# Altium project VapourPhaseReflowShield.PrjPcb
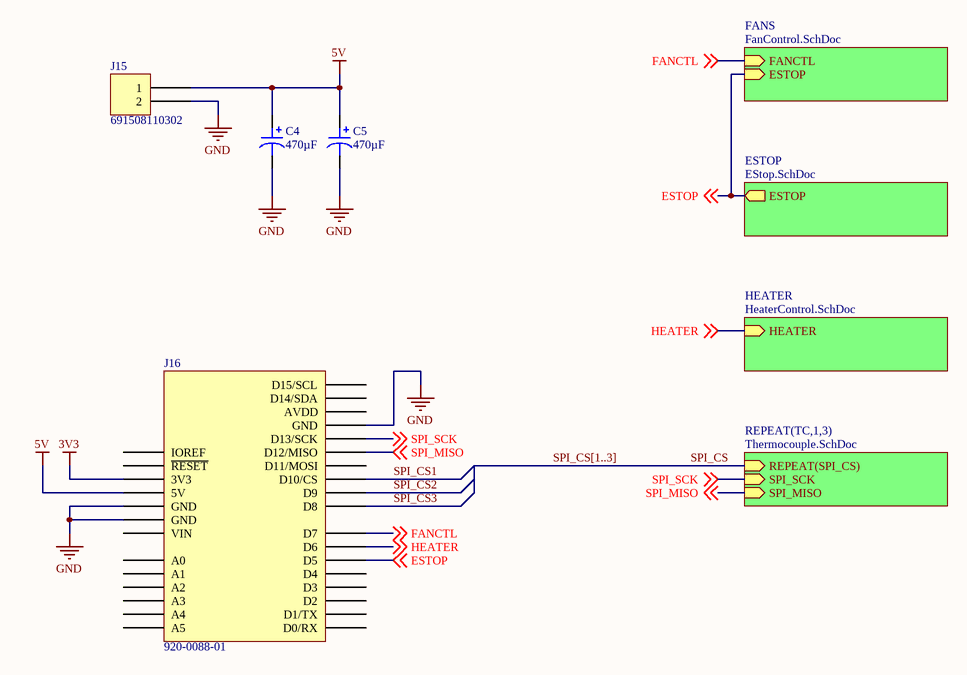
[diagram p0: VapourPhaseController.SchDoc]
5 sheets, 38 parts. Net scope: hierarchical (ports join the sheet entries above them; power ports are global).
Board file: Vapour Phase Shield.PcbDoc
Sheets:
  VapourPhaseController.SchDoc
    FANS = FanControl.SchDoc
    HEATER = HeaterControl.SchDoc
    TC1 = Thermocouple.SchDoc
    TC2 = Thermocouple.SchDoc
    TC3 = Thermocouple.SchDoc
    ESTOP = EStop.SchDoc

## Sheet VapourPhaseController.SchDoc: Vapour Phase Reflow Shield
size A4

### Parts
C4  470µF  [CAP AL TH D8 L3.5 H12.5]
C5  470µF  [CAP AL TH D8 L3.5 H12.5]
J15  691508110302  [WURTH 691508110302]
J16  920-0088-01  [SCHMARTBOARD - 920-0088-01]

### Sub-sheets
ESTOP = EStop.SchDoc: ESTOP (out)
FANS = FanControl.SchDoc: FANCTL (in), ESTOP (in)
HEATER = HeaterControl.SchDoc: HEATER (in)
REPEAT(TC,1,3) = Thermocouple.SchDoc: SPI_SCK (in), REPEAT(SPI_CS) (in), SPI_MISO (in)

### Nets
3V3: J16.4(3V3)
5V: C4.1 C5.1 J15.1 J16.5(5V)
GND: C4.2 C5.2 J15.2 J16.6(GND) J16.7(GND) J16.29(GND)
ESTOP: J16.20(D5) ; off-sheet ESTOP, sheet FANS/ESTOP, sheet ESTOP/ESTOP
FANCTL: J16.22(D7) ; off-sheet FANCTL, sheet FANS/FANCTL
HEATER: J16.21(D6) ; off-sheet HEATER, sheet HEATER/HEATER  [project net HEATCTL]
SPI_CS: sheet REPEAT(TC,1,3)/REPEAT(SPI_CS)
SPI_CS1: J16.25(D10/CS)
SPI_CS2: J16.24(D9)
SPI_CS3: J16.23(D8)
SPI_MISO: J16.27(D12/MISO) ; off-sheet SPI_MISO, sheet REPEAT(TC,1,3)/SPI_MISO
SPI_SCK: J16.28(D13/SCK) ; off-sheet SPI_SCK, sheet REPEAT(TC,1,3)/SPI_SCK

Not connected (* = marked no-connect by the designer): J16 2(IOREF) 3(~{RESET}) 8(VIN) 9(A0) 10(A1) 11(A2) 12(A3) 13(A4) 14(A5) 15(D0/RX) 16(D1/TX) 17(D2) 18(D3) 19(D4) 26(D11/MOSI) 30(AVDD) 31(D14/SDA) 32(D15/SCL)

### Buses and harness runs
bus SPI_CS[1..3]

### Notes on the sheet
- Title
- Size:
- Date:
- A4
- Number:
- Time:
- Revision:
- Sheet
- of
- File:

### Library data of the parts
C4 C5 = ECA-1CM471: CAP ALUM 470UF 20% 16V RADIAL; Manufacturer: Panasonic Electronic Components; Lifetime @ Temp.: 2000 Hrs @ 85°C; Polarization: Polar; Ripple Current @ High Frequency: 748mA @ 10kHz; Ripple Current @ Low Frequency: 440mA @ 120Hz; Part Number: ECA-1CM471; Applications: General Purpose; Capacitance: 470µF; ComponentLink1Description: Datasheet; ComponentLink1URL: //media.digikey.com/pdf/Data%20Sheets/Panasonic%20Electronic%20Components/ECA-xxM%20Series,TypeA.pdf; ComponentLink2Description: DigiKey Link; ComponentLink2URL: http://digikey.com/product-detail/en/panasonic-electronic-components/ECA-1CM471/P5141-ND/245000; Device Package: Radial, Can; Height - Seated (Max): 0.492" (12.50mm); LastUpdated: 21/01/2020 03:40:57; Lead Spacing: 0.138" (3.50mm); Lifecycle Status: Active; Minimum Order: 1; Mounting Type: Through Hole; Operating Temperature: -40°C ~ 85°C; Package / Case: Radial, Can; Packaging: Bulk; PartId: 7263; Part Status: Active; Price: 0.10; Series: M; Size / Dimension: 0.315" Dia (8.00mm); Supplier 1: DigiKey; Supplier Part Number 1: P5141-ND; Tolerance: ±20%; Value: 470µF; Voltage - Rated: 16V
J15 = 691508110302: TERM BLOCK 2POS 3.5MM SMD; Manufacturer: Würth Elektronik; Current: 10A; Mating Orientation: Horizontal and Vertical with Board; Number of Levels: 1; Pitch: 0.138" (3.50mm); Positions Per Level: 2; Voltage: 300V; Wire Gauge: 16-30 AWG; Wire Termination: Screw - Rising Cage Clamp; Part Number: 691508110302; Color: Black; ComponentLink1Description: Datasheet; ComponentLink1URL: https://katalog.we-online.de/em/datasheet/6915081103xx.pdf; ComponentLink2Description: DigiKey Link; ComponentLink2URL: http://digikey.com/product-detail/en/w-rth-elektronik/691508110302/732-5963-1-ND/5047612; Features: Board Guide, Mounting Flange; LastUpdated: 15/01/2020 04:18:55; Lifecycle Status: Active; Minimum Order: 1; Mounting Type: Surface Mount; Packaging: TapeAndReel; Part Status: Active; Price: 1.57; Series: WR-TBL Series 5081; Supplier 1: DigiKey; Supplier Part Number 1: 732-5963-1-ND
J16 = 920-0088-01: CONN HDR 8/10P 0.1 GOLD PCB 6PC; Manufacturer: Schmartboard, Inc.; Connector Type: Header; Contact Length - Post: 0.413" (10.50mm); Number of Positions: 6, 8, 10; Number of Positions Loaded: All; Pitch - Mating: 0.100" (2.54mm); Style: Board to Board; ComponentLink1Description: Datasheet; ComponentLink1URL: http://schmartboard.com/content/Brochures/920-0088-01.pdf; ComponentLink2Description: DigiKey Link; ComponentLink2URL: http://digikey.com/product-detail/en/schmartboard-inc/920-0088-01/1988-1036-ND/9559319; Contact Finish - Mating: Gold; Contact Finish - Post: Gold; Contact Type: Female Socket; Fastening Type: Push-Pull; Insulation Color: Black; Insulation Height: 0.335" (8.51mm); LastUpdated: 31/01/2020 20:49:58; Lifecycle Status: Active; Part Number: 920-0088-01; Minimum Order: 1; Mounting Type: Through Hole; Number of Rows: 1; Packaging: Bulk; Part Status: Active; Price: 5.00; Series: -; Supplier 1: DigiKey; Supplier Part Number 1: 1988-1036-ND; Termination: Solder

## Sheet FanControl.SchDoc
size A4
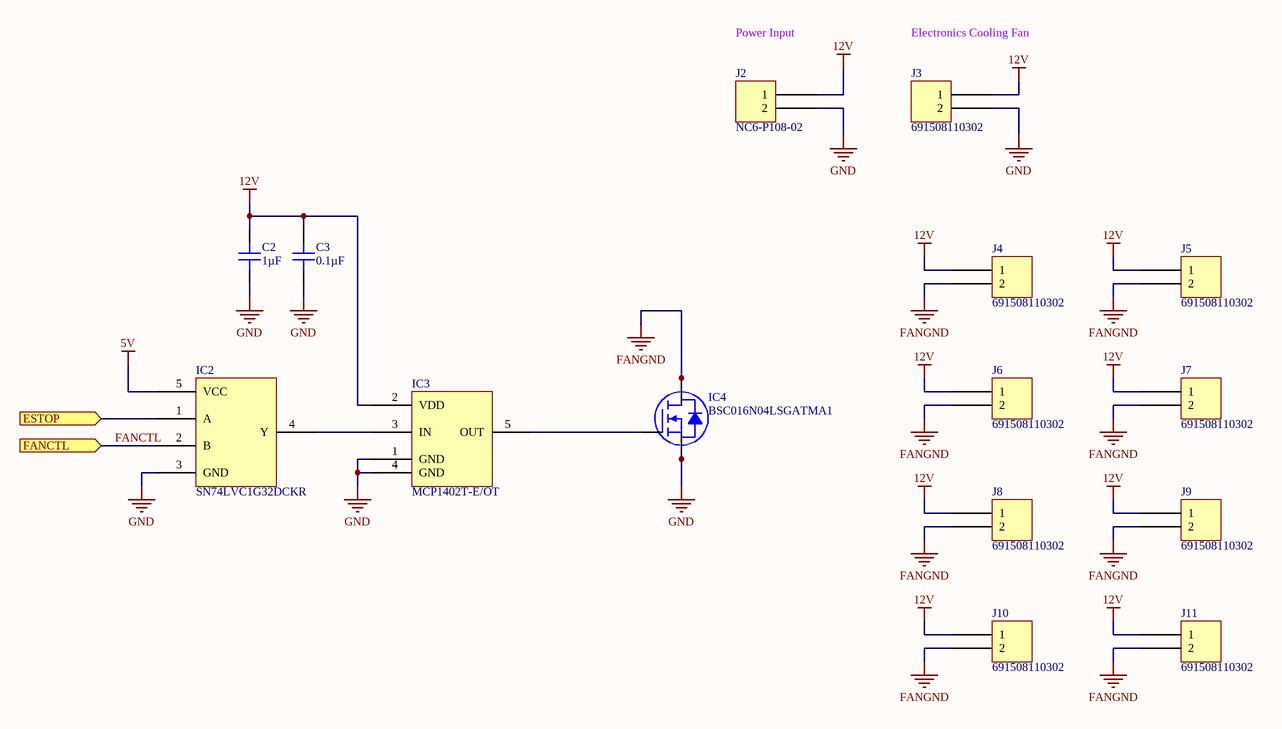
[diagram p1: FanControl.SchDoc]

### Parts
C2  1µF  [CAP 0603_1608]
C3  0.1µF  [CAP 0603_1608]
IC2  SN74LVC1G32DCKR  [TI SC70-6 DCK]
IC3  MCP1402T-E/OT  [MICROCHIP SOT-23-5 OT]
IC4  BSC016N04LSGATMA1  [INFINEON PG-TDSON-8]
J2  NC6-P108-02  [TE NC6-P108-02]
J3  691508110302  [WURTH 691508110302]
J4  691508110302  [WURTH 691508110302]
J5  691508110302  [WURTH 691508110302]
J6  691508110302  [WURTH 691508110302]
J7  691508110302  [WURTH 691508110302]
J8  691508110302  [WURTH 691508110302]
J9  691508110302  [WURTH 691508110302]
J10  691508110302  [WURTH 691508110302]
J11  691508110302  [WURTH 691508110302]

### Ports
ESTOP (in), FANCTL (in)

### Nets
5V: IC2.5(VCC)
12V: C2.2 C3.2 IC3.2(VDD) J2.1 J3.1 J4.1 J5.1 J6.1 J7.1 J8.1 J9.1 J10.1 J11.1
FANGND: IC4.5(D) IC4.6(D) IC4.7(D) IC4.8(D) J4.2 J5.2 J6.2 J7.2 J8.2 J9.2 J10.2 J11.2
GND: C2.1 C3.1 IC2.3(GND) IC3.1(GND) IC3.4(GND) IC4.1(S) IC4.2(S) IC4.3(S) J2.2 J3.2
ESTOP: IC2.1(A) ; port ESTOP
FANCTL: IC2.2(B) ; port FANCTL
NetIC2_4: IC2.4(Y) IC3.3(IN)
NetIC3_5: IC3.5(OUT) IC4.4(G)

### Notes on the sheet
- Power Input
- Electronics Cooling Fan
- Title
- Size:
- Date:
- A4
- Number:
- Time:
- Revision:
- Sheet
- of
- File:

### Library data of the parts
C2 = CC0603KRX5R8BB105: CAP CER 1UF 25V X5R 0603; Manufacturer: Yageo; Tolerance: ±10%; Part Number: CC0603KRX5R8BB105; Value: 1µF; Applications: General Purpose; Capacitance: 1µF; ComponentLink1Description: Datasheet; ComponentLink1URL: https://www.yageo.com/upload/media/product/productsearch/datasheet/mlcc/UPY-GPHC_X5R_4V-to-50V_25.pdf; ComponentLink2Description: DigiKey Link; ComponentLink2URL: http://digikey.com/product-detail/en/yageo/CC0603KRX5R8BB105/311-1445-1-ND/2833751; Device Package: 0603 (1608 Metric); LastUpdated: 21/01/2020 00:02:05; Lifecycle Status: Active; Minimum Order: 1; Mounting Type: Surface Mount, MLCC; Operating Temperature: -55°C ~ 85°C; Package / Case: 0603 (1608 Metric); Packaging: TapeAndReel; PartId: 5146; Part Status: Active; Price: 0.01; Series: CC; Size / Dimension: 0.063" L x 0.031" W (1.60mm x 0.80mm); Supplier 1: DigiKey; Supplier Part Number 1: 311-1445-1-ND; Temperature Coefficient: X5R; Thickness (Max): 0.035" (0.90mm); Voltage - Rated: 25V
C3 = 06035C104JAT4A: CAP CER 0.1UF 50V X7R 0603; Manufacturer: AVX Corporation; Tolerance: ±5%; Part Number: 06035C104JAT4A; Value: 0.1µF; Applications: General Purpose; Capacitance: 0.1µF; ComponentLink1Description: Datasheet; ComponentLink1URL: http://datasheets.avx.com/X7RDielectric.pdf; ComponentLink2Description: DigiKey Link; ComponentLink2URL: http://digikey.com/product-detail/en/avx-corporation/06035C104JAT4A/478-12459-1-ND/9749311; Device Package: 0603 (1608 Metric); LastUpdated: 21/01/2020 00:02:08; Lifecycle Status: Active; Minimum Order: 1; Mounting Type: Surface Mount, MLCC; Operating Temperature: -55°C ~ 125°C; Package / Case: 0603 (1608 Metric); Packaging: TapeAndReel; PartId: 3002; Part Status: Active; Price: 0.01; Series: -; Size / Dimension: 0.063" L x 0.032" W (1.60mm x 0.81mm); Supplier 1: DigiKey; Supplier Part Number 1: 478-12459-1-ND; Temperature Coefficient: X7R; Thickness (Max): 0.035" (0.90mm); Voltage - Rated: 50V
IC2 = SN74LVC1G32DCKR: IC GATE OR 1CH 2-INP SC70-5; Manufacturer: Texas Instruments; Current - Output High, Low: 32mA, 32mA; Current - Quiescent (Max): 10µA; Logic Level - High: 1.7V ~ 2V; Logic Level - Low: 0.7V ~ 0.8V; Logic Type: OR Gate; Max Propagation Delay @ V, Max CL: 4ns @ 5V, 50pF; Number of Circuits: 1; Number of Inputs: 2; Voltage - Supply: 1.65V ~ 5.5V; Part Number: SN74LVC1G32DCKR; ComponentLink1Description: Datasheet; ComponentLink1URL: http://www.ti.com/general/docs/suppproductinfo.tsp?distId=10&gotoUrl=http%3A%2F%2Fwww.ti.com%2Flit%2Fgpn%2Fsn74lvc1g32; ComponentLink2Description: DigiKey Link; ComponentLink2URL: http://digikey.com/product-detail/en/texas-instruments/SN74LVC1G32DCKR/296-9848-1-ND/380106; Device Package: 5-TSSOP, SC-70-5, SOT-353; LastUpdated: 31/01/2020 03:20:00; Lifecycle Status: Active; Minimum Order: 1; Mounting Type: Surface Mount; Operating Temperature: -40°C ~ 125°C; Package / Case: 5-TSSOP, SC-70-5, SOT-353; Packaging: TapeAndReel; PartId: 3; Part Status: Active; Price: 0.05; Series: 74LVC; Supplier 1: DigiKey; Supplier Part Number 1: 296-9848-1-ND; Supplier Device Package: SC-70-5
IC3 = MCP1402T-E/OT: IC GATE DRVR LOW-SIDE SOT23-5; Manufacturer: Microchip Technology; Channel Type: Single; Current - Peak Output (Source, Sink): 500mA, 500mA; Gate Type: IGBT, N-Channel, P-Channel MOSFET; Input Type: Non-Inverting; Logic Voltage - VIL, VIH: 0.8V, 2.4V; Number of Drivers: 1; Rise / Fall Time (Typ): 19ns, 15ns; Voltage - Supply: 4.5V ~ 18V; Part Number: MCP1402T-E/OT; ComponentLink1Description: Datasheet; ComponentLink1URL: http://www.microchip.com/mymicrochip/filehandler.aspx?ddocname=en530890; ComponentLink2Description: DigiKey Link; ComponentLink2URL: http://digikey.com/product-detail/en/microchip-technology/MCP1402T-E-OT/MCP1402T-E-OTCT-ND/1956554; Device Package: SC-74A, SOT-753; Driven Configuration: Low-Side; LastUpdated: 31/01/2020 01:34:33; Lifecycle Status: Active; Minimum Order: 1; Mounting Type: Surface Mount; Operating Temperature: -40°C ~ 150°C (TJ); Package / Case: SC-74A, SOT-753; Packaging: TapeAndReel; PartId: 10; Part Status: Active; Price: 0.47; Series: -; Supplier 1: DigiKey; Supplier Part Number 1: MCP1402T-E/OTCT-ND; Supplier Device Package: SOT-23-5
IC4 = BSC016N04LSGATMA1: MOSFET N-CH 40V 100A TDSON-8; Manufacturer: Infineon Technologies; Current - Continuous Drain (Id) @ 25°C: 31A (Ta), 100A (Tc); Drive Voltage (Max Rds On,  Min Rds On): 4.5V, 10V; FET Type: N-Channel; Gate Charge (Qg) (Max) @ Vgs: 150nC @ 10V; Input Capacitance (Ciss) (Max) @ Vds: 12000pF @ 20V; Power Dissipation (Max): 2.5W (Ta), 139W (Tc); Rds On (Max) @ Id, Vgs: 1.6mOhm @ 50A, 10V; Vgs (Max): ±20V; Vgs(th) (Max) @ Id: 2V @ 85µA; Part Number: BSC016N04LSGATMA1; ComponentLink1Description: Datasheet; ComponentLink1URL: https://www.infineon.com/dgdl/BSC016N04LSG_rev1.6.pdf?folderId=db3a304313b8b5a60113cee8763b02d7&fileId=db3a304318a6cd680118efe284830226; ComponentLink2Description: DigiKey Link; ComponentLink2URL: http://digikey.com/product-detail/en/infineon-technologies/BSC016N04LSGATMA1/BSC016N04LSGATMA1CT-ND/2231025; Device Package: 8-PowerTDFN; Drain to Source Voltage (Vdss): 40V; LastUpdated: 21/01/2020 03:59:50; Lifecycle Status: Active; Minimum Order: 1; Mounting Type: Surface Mount; Operating Temperature: -55°C ~ 150°C (TJ); Package / Case: 8-PowerTDFN; Packaging: TapeAndReel; Part Status: Active; Price: 0.95; Series: OptiMOS™; Supplier 1: DigiKey; Supplier Part Number 1: BSC016N04LSGATMA1CT-ND; Supplier Device Package: PG-TDSON-8-1; Technology: MOSFET (Metal Oxide)
J2 = NC6-P108-02: CONN BARRIER STRIP 2CIRC 0.375"; Manufacturer: TE Connectivity AMP Connectors; Barrier Type: 2 Wall (Dual); Bottom Termination: PC Pin; Current Rating (Amps): 20A; Number of Circuits: 2; Pitch: 0.375" (9.53mm); Top Termination: Screws with Captive Plate; Voltage Rating: 300V; Wire Gauge: 12-22 AWG; Part Number: NC6-P108-02; Color: Black; ComponentLink1Description: Datasheet; ComponentLink1URL: https://www.te.com/commerce/DocumentDelivery/DDEController?Action=srchrtrv&DocNm=3-1437664-0&DocType=Customer+Drawing&DocLang=English; ComponentLink2Description: DigiKey Link; ComponentLink2URL: http://digikey.com/product-detail/en/te-connectivity-amp-connectors/NC6-P108-02/A98495-ND/1277926; LastUpdated: 15/01/2020 04:11:24; Lifecycle Status: Active; Minimum Order: 1; Number of Rows: 1; Number of Wire Entries: 2; Packaging: Bulk; Part Status: Active; Price: 1.56; Series: NC6, Buchanan; Supplier 1: DigiKey; Supplier Part Number 1: A98495-ND; Terminal Block Type: Barrier Block
J3-J11 = 691508110302: as J15 on sheet VapourPhaseController; Part Number: 691508110302; Color: Black; ComponentLink1Description: Datasheet; ComponentLink1URL: https://katalog.we-online.de/em/datasheet/6915081103xx.pdf; ComponentLink2Description: DigiKey Link; ComponentLink2URL: http://digikey.com/product-detail/en/w-rth-elektronik/691508110302/732-5963-1-ND/5047612; Features: Board Guide, Mounting Flange; LastUpdated: 15/01/2020 04:18:55; Lifecycle Status: Active; Minimum Order: 1; Mounting Type: Surface Mount; Packaging: TapeAndReel; Part Status: Active; Price: 1.57; Series: WR-TBL Series 5081; Supplier 1: DigiKey; Supplier Part Number 1: 732-5963-1-ND

## Sheet HeaterControl.SchDoc
size A4
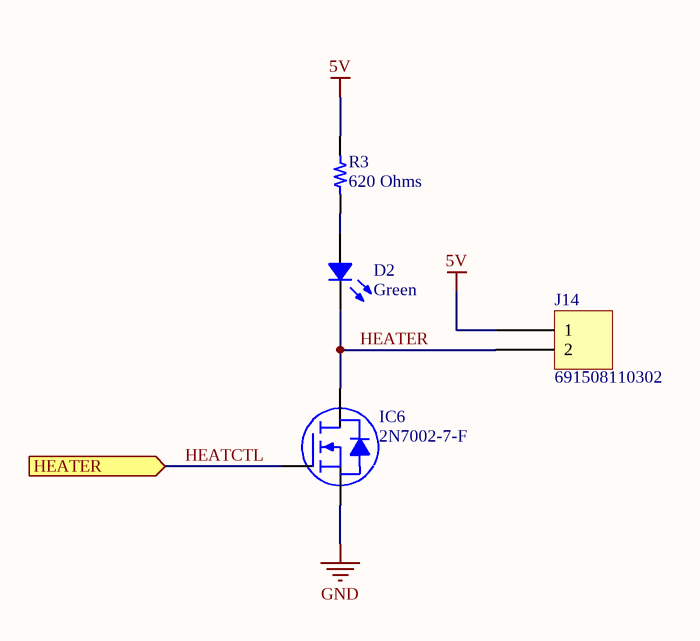
[diagram p2: HeaterControl.SchDoc]

### Parts
D2  Green  [LED 0603_1608 GREEN]
IC6  2N7002-7-F  [DIODES SOT-23-3]
J14  691508110302  [WURTH 691508110302]
R3  620 Ohms  [RES 0603_1608]

### Ports
HEATER (in)

### Nets
5V: J14.1 R3.2
GND: IC6.2(S)
HEATCTL: IC6.1(G) ; port HEATER
HEATER: D2.2 IC6.3(D) J14.2
NetD2_1: D2.1 R3.1

### Notes on the sheet
- Title
- Size:
- Date:
- A4
- Number:
- Time:
- Revision:
- Sheet
- of
- File:

### Library data of the parts
D2 = LTST-C190KGKT: LED GREEN CLEAR CHIP SMD; Manufacturer: Lite-On Inc.; Configuration: Standard; Current - Test: 20mA; Lens Color: Colorless; Lens Size: 1.10mm x 0.80mm; Lens Style: Rectangle with Flat Top; Millicandela Rating: 35mcd; Viewing Angle: 130°; Voltage - Forward (Vf) (Typ): 2V; Wavelength - Dominant: 571nm; Wavelength - Peak: 574nm; Part Number: LTST-C190KGKT; Color: Green; ComponentLink1Description: Datasheet; ComponentLink1URL: http://optoelectronics.liteon.com/upload/download/DS22-2000-074/LTST-C190KGKT.PDF; ComponentLink2Description: DigiKey Link; ComponentLink2URL: http://digikey.com/product-detail/en/lite-on-inc/LTST-C190KGKT/160-1435-1-ND/386814; Device Package: 0603 (1608 Metric); Height (Max): 0.90mm; LastUpdated: 21/01/2020 03:12:09; Lens Transparency: Clear; Lifecycle Status: Active; Minimum Order: 1; Mounting Type: Surface Mount; Package / Case: 0603 (1608 Metric); Packaging: TapeAndReel; PartId: 657; Part Status: Active; Price: 0.04; Series: -; Size / Dimension: 1.60mm L x 0.80mm W; Supplier 1: DigiKey; Supplier Part Number 1: 160-1435-1-ND; Supplier Device Package: Chip LED; Value: Green
IC6 = 2N7002-7-F: MOSFET N-CH 60V 115MA SOT23-3; Manufacturer: Diodes Incorporated; Current - Continuous Drain (Id) @ 25°C: 115mA (Ta); Drive Voltage (Max Rds On,  Min Rds On): 5V, 10V; FET Type: N-Channel; Input Capacitance (Ciss) (Max) @ Vds: 50pF @ 25V; Power Dissipation (Max): 370mW (Ta); Rds On (Max) @ Id, Vgs: 7.5Ohm @ 50mA, 5V; Vgs (Max): ±20V; Vgs(th) (Max) @ Id: 2.5V @ 250µA; Part Number: 2N7002-7-F; ComponentLink1Description: Datasheet; ComponentLink1URL: https://www.diodes.com/assets/Datasheets/ds11303.pdf; ComponentLink2Description: DigiKey Link; ComponentLink2URL: http://digikey.com/product-detail/en/diodes-incorporated/2N7002-7-F/2N7002-FDICT-ND/717800; Device Package: TO-236-3, SC-59, SOT-23-3; Drain to Source Voltage (Vdss): 60V; LastUpdated: 21/01/2020 04:00:25; Lifecycle Status: Active; Minimum Order: 1; Mounting Type: Surface Mount; Operating Temperature: -55°C ~ 150°C (TJ); Package / Case: TO-236-3, SC-59, SOT-23-3; Packaging: TapeAndReel; Part Status: Active; Price: 0.03; Series: -; Supplier 1: DigiKey; Supplier Part Number 1: 2N7002-FDICT-ND; Supplier Device Package: SOT-23-3; Technology: MOSFET (Metal Oxide)
J14 = 691508110302: as J15 on sheet VapourPhaseController; Part Number: 691508110302; Color: Black; ComponentLink1Description: Datasheet; ComponentLink1URL: https://katalog.we-online.de/em/datasheet/6915081103xx.pdf; ComponentLink2Description: DigiKey Link; ComponentLink2URL: http://digikey.com/product-detail/en/w-rth-elektronik/691508110302/732-5963-1-ND/5047612; Features: Board Guide, Mounting Flange; LastUpdated: 15/01/2020 04:18:55; Lifecycle Status: Active; Minimum Order: 1; Mounting Type: Surface Mount; Packaging: TapeAndReel; Part Status: Active; Price: 1.57; Series: WR-TBL Series 5081; Supplier 1: DigiKey; Supplier Part Number 1: 732-5963-1-ND
R3 = ERJ-3GEYJ621V: RES SMD 620 OHM 5% 1/10W 0603; Manufacturer: Panasonic Electronic Components; Power (Watts): 0.1W, 1/10W; Temperature Coefficient: ±200ppm/°C; Part Number: ERJ-3GEYJ621V; Value: 620 Ohms; ComponentLink1Description: Datasheet; ComponentLink1URL: http://industrial.panasonic.com/www-cgi/jvcr13pz.cgi?E+PZ+3+AOA0001+ERJ3GEYJ621V+7+WW; ComponentLink2Description: DigiKey Link; ComponentLink2URL: http://digikey.com/product-detail/en/panasonic-electronic-components/ERJ-3GEYJ621V/P620GCT-ND/134820; Composition: Thick Film; Device Package: 0603 (1608 Metric); Features: Automotive AEC-Q200; Height - Seated (Max): 0.022" (0.55mm); LastUpdated: 21/01/2020 00:23:40; Lifecycle Status: Active; Minimum Order: 1; Number of Terminations: 2; Operating Temperature: -55°C ~ 155°C; Package / Case: 0603 (1608 Metric); Packaging: TapeAndReel; PartId: 8112; Part Status: Active; Price: 0.01; Ratings: AEC-Q200; Resistance: 620 Ohms; Series: ERJ; Size / Dimension: 0.063" L x 0.031" W (1.60mm x 0.80mm); Supplier 1: DigiKey; Supplier Part Number 1: P620GCT-ND; Supplier Device Package: 0603; Tolerance: ±5%

## Sheet Thermocouple.SchDoc
size A4
Used 3 times, as channels TC1, TC2, TC3. Parts and nets are listed once, with the designators drawn on the sheet.
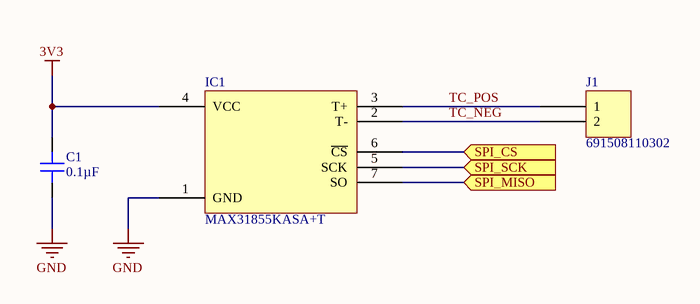
[diagram p3: Thermocouple.SchDoc]

### Parts
C1  0.1µF  [CAP 0603_1608]
IC1  MAX31855KASA+T  [MAXIM SOIC-8 S8]
J1  691508110302  [WURTH 691508110302]

### Ports
SPI_CS (in), SPI_MISO (in), SPI_SCK (in)

### Nets
3V3: C1.2 IC1.4(VCC)
GND: C1.1 IC1.1(GND)
SPI_CS: IC1.6(~{CS}) ; port SPI_CS
SPI_MISO: IC1.7(SO) ; port SPI_MISO
SPI_SCK: IC1.5(SCK) ; port SPI_SCK
TC_NEG: IC1.2(T-) J1.2
TC_POS: IC1.3(T+) J1.1

### Channels
TC1: designators end in _TC1; ports SPI_CS=SPI_CS1 SPI_MISO=SPI_MISO SPI_SCK=SPI_SCK
TC2: designators end in _TC2; ports SPI_CS=SPI_CS2 SPI_MISO=SPI_MISO SPI_SCK=SPI_SCK
TC3: designators end in _TC3; ports SPI_CS=SPI_CS3 SPI_MISO=SPI_MISO SPI_SCK=SPI_SCK

### Notes on the sheet
- Title
- Size:
- Date:
- A4
- Number:
- Time:
- Revision:
- Sheet
- of
- File:

### Library data of the parts
C1 = 06035C104JAT4A: as C3 on sheet FanControl; Part Number: 06035C104JAT4A; Value: 0.1µF; Applications: General Purpose; Capacitance: 0.1µF; ComponentLink1Description: Datasheet; ComponentLink1URL: http://datasheets.avx.com/X7RDielectric.pdf; ComponentLink2Description: DigiKey Link; ComponentLink2URL: http://digikey.com/product-detail/en/avx-corporation/06035C104JAT4A/478-12459-1-ND/9749311; Device Package: 0603 (1608 Metric); LastUpdated: 21/01/2020 00:02:08; Lifecycle Status: Active; Minimum Order: 1; Mounting Type: Surface Mount, MLCC; Operating Temperature: -55°C ~ 125°C; Package / Case: 0603 (1608 Metric); Packaging: TapeAndReel; PartId: 3002; Part Status: Active; Price: 0.01; Series: -; Size / Dimension: 0.063" L x 0.032" W (1.60mm x 0.81mm); Supplier 1: DigiKey; Supplier Part Number 1: 478-12459-1-ND; Temperature Coefficient: X7R; Thickness (Max): 0.035" (0.90mm); Voltage - Rated: 50V
IC1 = MAX31855KASA+T: IC CONV THERMOCOUPLE-DGTL 8SOIC; Manufacturer: Maxim Integrated; Current - Supply: 900µA; Input Type: Thermocouple (Multiple); Output Type: Digital; ComponentLink1Description: Datasheet; ComponentLink1URL: https://datasheets.maximintegrated.com/en/ds/MAX31855.pdf; ComponentLink2Description: DigiKey Link; ComponentLink2URL: http://digikey.com/product-detail/en/maxim-integrated/MAX31855KASA-T/MAX31855KASA-TCT-ND/2708805; Device Package: 8-SOIC (0.154", 3.90mm Width); LastUpdated: 30/01/2020 23:28:47; Lifecycle Status: Active; Part Number: MAX31855KASA+T; Minimum Order: 1; Mounting Type: Surface Mount; Operating Temperature: -40°C ~ 125°C; Package / Case: 8-SOIC (0.154", 3.90mm Width); Packaging: TapeAndReel; Part Status: Active; Price: 3.35; Series: -; Supplier 1: DigiKey; Supplier Part Number 1: MAX31855KASA+TCT-ND; Supplier Device Package: 8-SOIC; Type: Thermocouple to Digital Converter
J1 = 691508110302: as J15 on sheet VapourPhaseController; Part Number: 691508110302; Color: Black; ComponentLink1Description: Datasheet; ComponentLink1URL: https://katalog.we-online.de/em/datasheet/6915081103xx.pdf; ComponentLink2Description: DigiKey Link; ComponentLink2URL: http://digikey.com/product-detail/en/w-rth-elektronik/691508110302/732-5963-1-ND/5047612; Features: Board Guide, Mounting Flange; LastUpdated: 15/01/2020 04:18:55; Lifecycle Status: Active; Minimum Order: 1; Mounting Type: Surface Mount; Packaging: TapeAndReel; Part Status: Active; Price: 1.57; Series: WR-TBL Series 5081; Supplier 1: DigiKey; Supplier Part Number 1: 732-5963-1-ND

## Sheet EStop.SchDoc
size A4
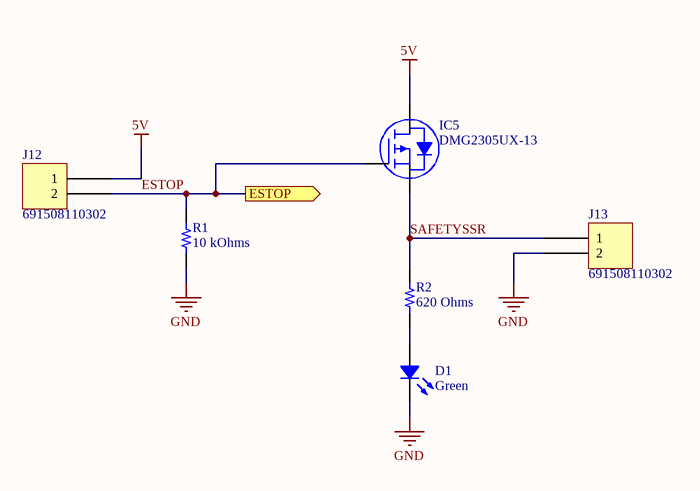
[diagram p4: EStop.SchDoc]

### Parts
D1  Green  [LED 0603_1608 GREEN]
IC5  DMG2305UX-13  [DIODES SOT-23-3]
J12  691508110302  [WURTH 691508110302]
J13  691508110302  [WURTH 691508110302]
R1  10 kOhms  [RES 0603_1608]
R2  620 Ohms  [RES 0603_1608]

### Ports
ESTOP (out)

### Nets
5V: IC5.3(D) J12.1
GND: D1.2 J13.2 R1.1
ESTOP: IC5.1(G) J12.2 R1.2 ; port ESTOP
SAFETYSSR: IC5.2(S) J13.1 R2.2
NetD1_1: D1.1 R2.1

### Notes on the sheet
- Title
- Size:
- Date:
- A4
- Number:
- Time:
- Revision:
- Sheet
- of
- File:

### Library data of the parts
D1 = LTST-C190KGKT: as D2 on sheet HeaterControl; Part Number: LTST-C190KGKT; Color: Green; ComponentLink1Description: Datasheet; ComponentLink1URL: http://optoelectronics.liteon.com/upload/download/DS22-2000-074/LTST-C190KGKT.PDF; ComponentLink2Description: DigiKey Link; ComponentLink2URL: http://digikey.com/product-detail/en/lite-on-inc/LTST-C190KGKT/160-1435-1-ND/386814; Device Package: 0603 (1608 Metric); Height (Max): 0.90mm; LastUpdated: 21/01/2020 03:12:09; Lens Transparency: Clear; Lifecycle Status: Active; Minimum Order: 1; Mounting Type: Surface Mount; Package / Case: 0603 (1608 Metric); Packaging: TapeAndReel; PartId: 657; Part Status: Active; Price: 0.04; Series: -; Size / Dimension: 1.60mm L x 0.80mm W; Supplier 1: DigiKey; Supplier Part Number 1: 160-1435-1-ND; Supplier Device Package: Chip LED; Value: Green
IC5 = DMG2305UX-13: MOSFET P-CH 20V 4.2A SOT23; Manufacturer: Diodes Incorporated; Current - Continuous Drain (Id) @ 25°C: 4.2A (Ta); Drive Voltage (Max Rds On,  Min Rds On): 1.8V, 4.5V; FET Type: P-Channel; Gate Charge (Qg) (Max) @ Vgs: 10.2nC @ 4.5V; Input Capacitance (Ciss) (Max) @ Vds: 808pF @ 15V; Power Dissipation (Max): 1.4W (Ta); Rds On (Max) @ Id, Vgs: 52mOhm @ 4.2A, 4.5V; Vgs (Max): ±8V; Vgs(th) (Max) @ Id: 900mV @ 250µA; Part Number: DMG2305UX-13; ComponentLink1Description: Datasheet; ComponentLink1URL: https://www.diodes.com/assets/Datasheets/DMG2305UX.pdf; ComponentLink2Description: DigiKey Link; ComponentLink2URL: http://digikey.com/product-detail/en/diodes-incorporated/DMG2305UX-13/DMG2305UX-13DICT-ND/4251589; Device Package: TO-236-3, SC-59, SOT-23-3; Drain to Source Voltage (Vdss): 20V; LastUpdated: 21/01/2020 04:00:37; Lifecycle Status: Active; Minimum Order: 1; Mounting Type: Surface Mount; Operating Temperature: -55°C ~ 150°C (TJ); Package / Case: TO-236-3, SC-59, SOT-23-3; Packaging: TapeAndReel; Part Status: Active; Price: 0.05; Series: -; Supplier 1: DigiKey; Supplier Part Number 1: DMG2305UX-13DICT-ND; Supplier Device Package: SOT-23; Technology: MOSFET (Metal Oxide)
J12 J13 = 691508110302: as J15 on sheet VapourPhaseController; Part Number: 691508110302; Color: Black; ComponentLink1Description: Datasheet; ComponentLink1URL: https://katalog.we-online.de/em/datasheet/6915081103xx.pdf; ComponentLink2Description: DigiKey Link; ComponentLink2URL: http://digikey.com/product-detail/en/w-rth-elektronik/691508110302/732-5963-1-ND/5047612; Features: Board Guide, Mounting Flange; LastUpdated: 15/01/2020 04:18:55; Lifecycle Status: Active; Minimum Order: 1; Mounting Type: Surface Mount; Packaging: TapeAndReel; Part Status: Active; Price: 1.57; Series: WR-TBL Series 5081; Supplier 1: DigiKey; Supplier Part Number 1: 732-5963-1-ND
R1 = ERJ-PA3J103V: RES SMD 10K OHM 5% 1/4W 0603; Manufacturer: Panasonic Electronic Components; Power (Watts): 0.25W, 1/4W; Temperature Coefficient: ±200ppm/°C; Part Number: ERJ-PA3J103V; Value: 10 kOhms; ComponentLink1Description: Datasheet; ComponentLink1URL: https://industrial.panasonic.com/cdbs/www-data/pdf/RDO0000/AOA0000C331.pdf; ComponentLink2Description: DigiKey Link; ComponentLink2URL: http://digikey.com/product-detail/en/panasonic-electronic-components/ERJ-PA3J103V/P10KBZCT-ND/5036237; Composition: Thick Film; Device Package: 0603 (1608 Metric); Features: Automotive AEC-Q200, Pulse Withstanding; Height - Seated (Max): 0.022" (0.55mm); LastUpdated: 21/01/2020 00:23:23; Lifecycle Status: Active; Minimum Order: 1; Number of Terminations: 2; Operating Temperature: -55°C ~ 155°C; Package / Case: 0603 (1608 Metric); Packaging: TapeAndReel; PartId: 8965; Part Status: Active; Price: 0.01; Ratings: AEC-Q200; Resistance: 10 kOhms; Series: ERJ; Size / Dimension: 0.063" L x 0.031" W (1.60mm x 0.80mm); Supplier 1: DigiKey; Supplier Part Number 1: P10KBZCT-ND; Supplier Device Package: 0603; Tolerance: ±5%
R2 = ERJ-3GEYJ621V: as R3 on sheet HeaterControl; Part Number: ERJ-3GEYJ621V; Value: 620 Ohms; ComponentLink1Description: Datasheet; ComponentLink1URL: http://industrial.panasonic.com/www-cgi/jvcr13pz.cgi?E+PZ+3+AOA0001+ERJ3GEYJ621V+7+WW; ComponentLink2Description: DigiKey Link; ComponentLink2URL: http://digikey.com/product-detail/en/panasonic-electronic-components/ERJ-3GEYJ621V/P620GCT-ND/134820; Composition: Thick Film; Device Package: 0603 (1608 Metric); Features: Automotive AEC-Q200; Height - Seated (Max): 0.022" (0.55mm); LastUpdated: 21/01/2020 00:23:40; Lifecycle Status: Active; Minimum Order: 1; Number of Terminations: 2; Operating Temperature: -55°C ~ 155°C; Package / Case: 0603 (1608 Metric); Packaging: TapeAndReel; PartId: 8112; Part Status: Active; Price: 0.01; Ratings: AEC-Q200; Resistance: 620 Ohms; Series: ERJ; Size / Dimension: 0.063" L x 0.031" W (1.60mm x 0.80mm); Supplier 1: DigiKey; Supplier Part Number 1: P620GCT-ND; Supplier Device Package: 0603; Tolerance: ±5%

## Nets that join several sheets
3V3: VapourPhaseController (J16.4), TC1 (C1_TC1.2 IC1_TC1.4), TC2 (C1_TC2.2 IC1_TC2.4), TC3 (C1_TC3.2 IC1_TC3.4)
5V: VapourPhaseController (C4.1 C5.1 J15.1 J16.5), FanControl (IC2.5), HeaterControl (J14.1 R3.2), EStop (IC5.3 J12.1)
GND: VapourPhaseController (6 pins), FanControl (10 pins), HeaterControl (IC6.2), TC1 (C1_TC1.1 IC1_TC1.1), TC2 (C1_TC2.1 IC1_TC2.1), TC3 (C1_TC3.1 IC1_TC3.1), EStop (D1.2 J13.2 R1.1)
ESTOP: VapourPhaseController (J16.20), FanControl (IC2.1), EStop (IC5.1 J12.2 R1.2)
FANCTL: VapourPhaseController (J16.22), FanControl (IC2.2)
HEATCTL: VapourPhaseController (J16.21), HeaterControl (IC6.1)
SPI_CS1: VapourPhaseController (J16.25), TC1 (IC1_TC1.6)
SPI_CS2: VapourPhaseController (J16.24), TC2 (IC1_TC2.6)
SPI_CS3: VapourPhaseController (J16.23), TC3 (IC1_TC3.6)
SPI_MISO: VapourPhaseController (J16.27), TC1 (IC1_TC1.7), TC2 (IC1_TC2.7), TC3 (IC1_TC3.7)
SPI_SCK: VapourPhaseController (J16.28), TC1 (IC1_TC1.5), TC2 (IC1_TC2.5), TC3 (IC1_TC3.5)